# EAGLE design power-supply (EAGLE 7.3.0)
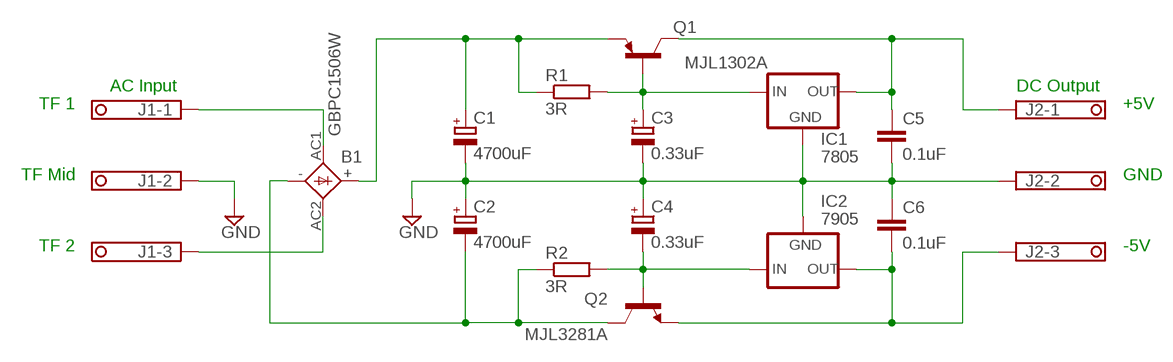
[diagram p0: schematic, sheet 1]

## Parts
B1  GBPC1506W  GBPC6  [GBPC6]
C1  4700uF  CPOL-EUE7.5-16  [E7,5-16]
C2  4700uF  CPOL-EUE7.5-16  [E7,5-16]
C3  0.33uF  CPOL-EUE2.5-5  [E2,5-5]
C4  0.33uF  CPOL-EUE2.5-5  [E2,5-5]
C5  0.1uF  C-EU102-054X133  [C102-054X133]
C6  0.1uF  C-EU102-054X133  [C102-054X133]
IC1  7805  78XXS  [78XXS]
IC2  7905  79XXS  [79XXS]
J1  1751251  [1751251]
J2  1751251  [1751251]
Q1  MJL1302A  [TO-264]
Q2  MJL3281A  [TO-264]
R1  3R  R-EU_0411/15  [0411/15]
R2  3R  R-EU_0411/15  [0411/15]

## Nets
GND: C1.- C2.+ C3.- C4.+ C5.2 C6.1 IC1.GND IC2.GND J1.2 J2.2
N$1: B1.AC1 J1.1
N$2: B1.AC2 J1.3
N$3: B1.+ C1.+ Q1.EMITTER R1.1
N$5: C3.+ IC1.IN Q1.BASE R1.2
N$6: C5.1 IC1.OUT J2.1 Q1.COLLECTOR
N$7: C4.- IC2.IN Q2.BASE R2.2
N$8: B1.- C2.- Q2.COLLECTOR R2.1
N$11: C6.2 IC2.OUT J2.3 Q2.EMITTER

## Notes on the sheet
- AC Input | DC Output
- TF 1 | +5V
- TF Mid | GND
- TF 2 | -5V

## Library data of the parts
B1 = rectifier:GBPC6: GENERAL INSTRUMENT RECTIFIER
C1-C4 = rcl:CPOL-EU: POLARIZED CAPACITOR, European symbol
C5 C6 = rcl:C-EU: CAPACITOR, European symbol
IC1 = v-reg:78XXS: VOLTAGE REGULATOR
IC2 = v-reg:79XXS: VOLTAGE REGULATOR
J1 J2 = con-phoenix-350:1751251: MKDS 1/ 3-3,5 Printklemme Nennstrom: 10 A Bemessungsspannung: 160 V Raster: 3,5 mm Polzahl: 3 Montageart: Löten Anschlussart: Schraubanschluss Anschlussrichtung vom Leiter zur Platine: 0° Source: http://eshop.phoenixcontact.com .. 1751251.pdf; OC_FARNELL: unknown; OC_NEWARK: unknown
Q1 = MJL1302A-MJL3281A:MJL1302A
Q2 = MJL1302A-MJL3281A:MJL3281A
R1 R2 = resistor:R-EU_: RESISTOR, European symbol

## Board
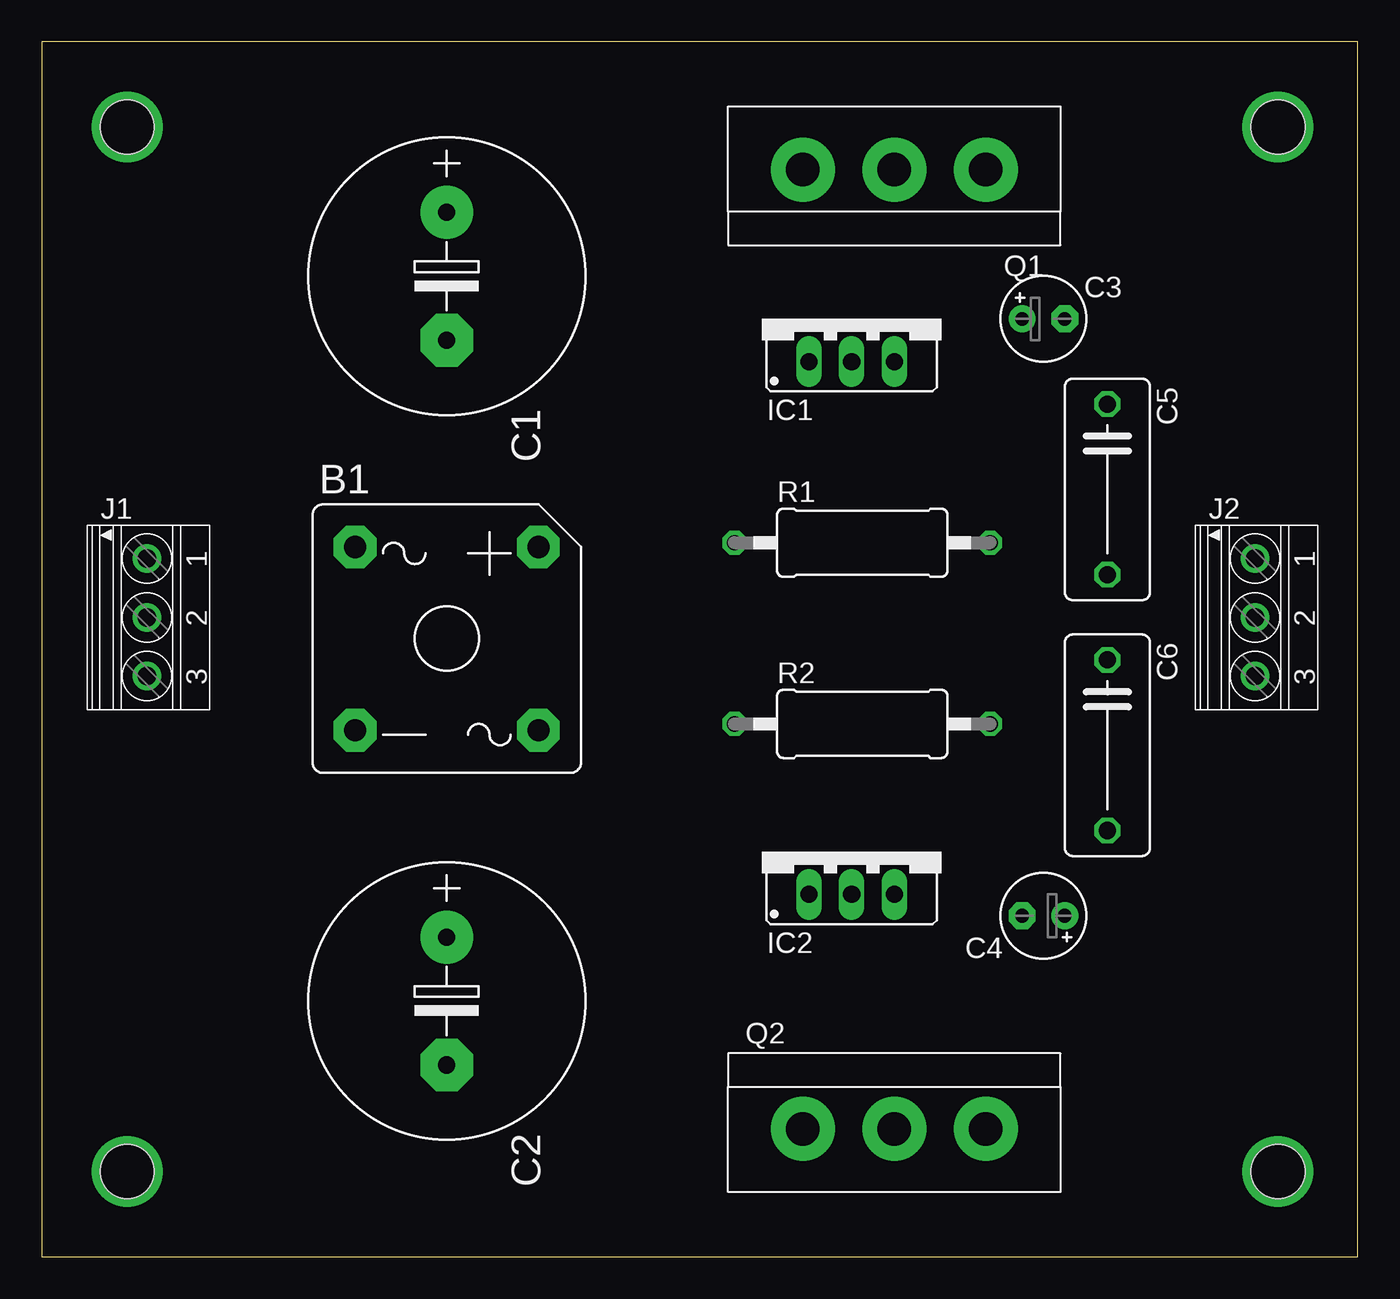
[diagram p1: board, top side]
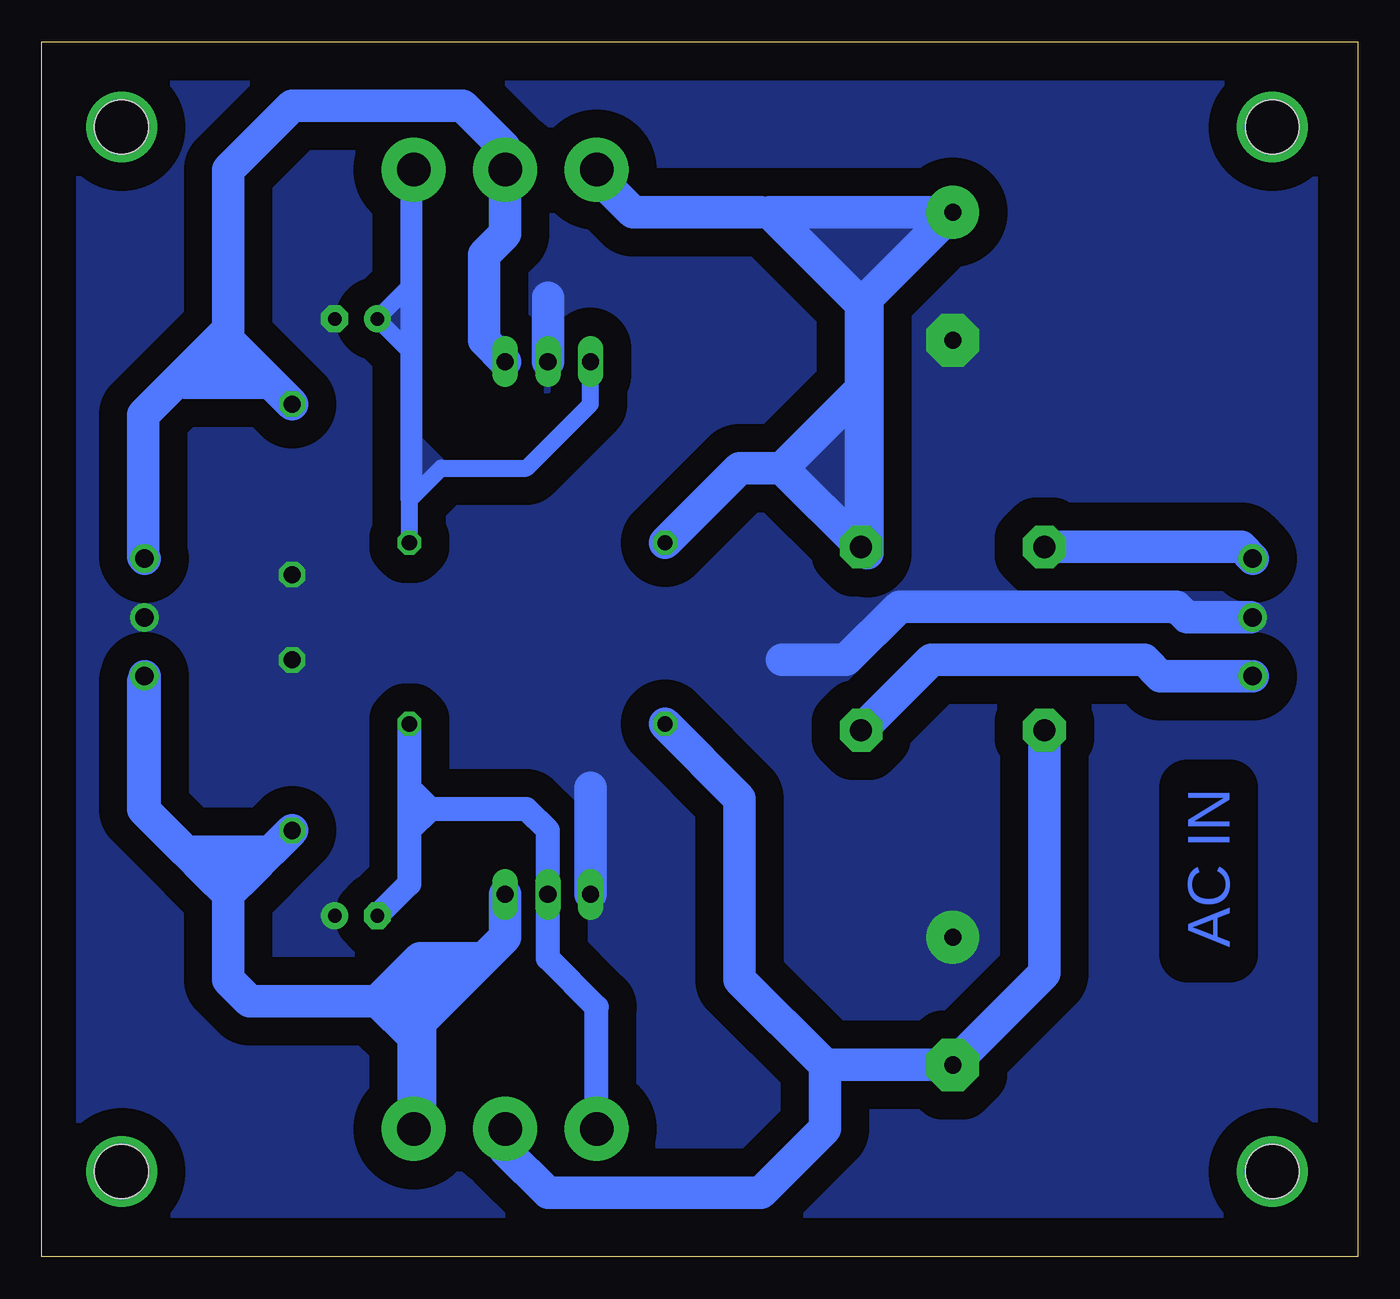
[diagram p2: board, bottom side, seen from below]

Size 78.41 x 72.38 mm. Coordinates in mm from the lower left corner, seen from the top.
Outline: 0,0 78.41,0 78.41,72.38 0,72.38 0,0
Copper layers (1*16): Top 0.035mm / dielectric 1mm / Bottom 0.035mm
Design rules "default *": minimum track width 10mil, minimum drill 24mil, track to track 8mil, track to pad 8mil, pad to pad 8mil, via to via 8mil, smd to smd 8mil, copper to edge 40mil, drill to drill 8mil, minimum pad ring 10mil, minimum via ring 8mil, stop-mask expansion 4mil, vias tented up to drill 0mil, thermal gap 10mil
Holes 3.2 mm at 5.08,67.31 73.66,67.31 5.08,5.08 73.66,5.08

### Footprints (pad centres in the part's own frame; a part is rotated, then mirrored left to right if it is on the bottom)
GBPC6 = drill 1.321 pad 2.54 octagon: + 5.461,5.461; - -5.461,-5.461; AC1 -5.461,5.461; AC2 5.461,-5.461
E7,5-16 = drill 1.016 pad 3.15: + -3.81,0 | drill 1.016 pad 3.15 octagon: - 3.81,0
E2,5-5 = drill 0.813 pad 1.6: + -1.27,0 | drill 0.813 pad 1.6 octagon: - 1.27,0
C102-054X133 = drill 1.016 octagon: 1 -5.08,0; 2 5.08,0
78XXS = drill 1.016 long: GND 0,-2.54; IN -2.54,-2.54; OUT 2.54,-2.54
79XXS = drill 1.016 long: GND -2.54,-2.54; IN 0,-2.54; OUT 2.54,-2.54
1751251 = drill 1.1 pad 1.7: 1 -3.5,-0.1; 2 0,-0.1; 3 3.5,-0.1
TO-264 = drill 2 pad 3.81: BASE -5.45,0; COLLECTOR 0,0; EMITTER 5.45,0
0411/15 = drill 0.914 octagon: 1 -7.62,0; 2 7.62,0

### Placement (x,y rotation side)
B1  24.13,36.83 0 top
C1  24.13,58.42 270 top
C2  24.13,15.24 270 top
C3  59.69,55.88 0 top
C4  59.69,20.32 180 top
C5  63.5,45.72 270 top
C6  63.5,30.48 270 top
IC1  48.26,55.88 0 top
IC2  48.26,24.13 0 top
J1  6.35,38.1 270 top
J2  72.39,38.1 270 top
Q1  50.8,64.77 180 top
Q2  50.8,7.62 0 top
R1  48.9,42.55 0 top
R2  48.9,31.75 0 top

### Tracks (layer width: path | path; a pad name or v marks a point on that pad's centre or on a via)
GND
  Bottom 1.93: IC1.GND 48.26,57.15 | 45.72,27.94 IC2.GND | 6.35,38.1 10.16,38.1 10.79,38.73 27.3,38.73 30.48,35.56 34.29,35.56
  pour Bottom (isolate 1.676, no thermals): 2.54,69.85 76.2,69.85 76.2,2.54 2.54,2.54
N$1
  Bottom 1.93: B1.AC1 6.94,42.29 J1.1
N$2
  Bottom 1.93: J1.3 11.74,34.6 12.7,35.56 25.4,35.56 B1.AC2
N$3
  Bottom 1.422: 35.05,62.23 35.56,62.23 42.81,62.23 Q1.EMITTER
  Bottom 1.93: 29.59,56.77 B1.+ 34.29,46.99 | 29.59,56.77 29.21,57.15 | 29.21,57.15 C1.+ 35.05,62.23 29.59,56.77 | 34.29,46.99 29.21,52.07 | 29.21,52.07 29.21,41.91 | 29.21,52.07 29.21,57.15 | R1.1 36.83,46.99 34.29,46.99 | 35.56,62.23 43.18,62.23 45.72,64.77
  pour Bottom: 24.13,62.23 29.21,57.15 34.29,62.23
  pour Bottom: 29.21,41.91 29.21,52.07 34.29,46.99
N$4  (via drill 3.2 pad 3.81)
  other vias: 73.66,67.31
N$5
  Bottom 1.016: Q1.BASE 56.25,45.35 | 56.25,45.35 56.52,45.09 | 56.52,45.09 R1.2 | 56.25,45.35 54.61,46.99 49.53,46.99 45.72,50.8 IC1.IN | 56.52,45.09 56.52,53.98 | 56.52,57.78 56.52,64.77 | 56.52,57.78 C3.+ 56.52,53.98 | 56.52,53.98 56.52,57.78
  pour Bottom: 54.61,46.99 56.52,48.9 56.52,45.09
  pour Bottom: 58.42,55.88 56.52,57.78 56.52,53.98
N$6
  Bottom 1.93: 67.31,54.61 67.31,55.24 | 67.31,55.24 67.31,64.77 63.5,68.58 53.34,68.58 50.8,66.04 Q1.COLLECTOR 50.8,60.96 52.07,59.69 52.07,54.61 IC1.OUT | 67.31,54.61 67.94,54.61 | 67.94,54.61 72.39,50.16 72.39,41.7 J2.1 | 67.94,54.61 67.31,55.24 | 67.31,54.61 66.04,53.34 | 66.04,53.34 64.77,52.07 | 64.77,52.07 C5.1 | 66.04,53.34 68.58,53.34 | 64.77,52.07 69.85,52.07
N$7
  Bottom 1.422: Q2.BASE 45.35,14.87 48.26,17.78 IC2.IN 48.26,25.4 49.53,26.67 55.24,26.67 | R2.2 56.52,27.94 | 56.52,27.94 56.52,26.04 | 56.52,25.4 56.52,22.23 C4.- | 55.24,26.67 55.88,26.67 56.52,26.04 | 56.52,26.04 56.52,25.4 | 56.52,25.4 55.24,26.67 | 55.24,26.67 56.52,27.94
N$8
  Bottom 1.93: 31.75,11.43 C2.- 18.67,16.89 B1.- | R2.1 36.83,27.3 36.83,16.51 31.75,11.43 | 31.75,11.43 31.75,7.62 35.56,3.81 48.26,3.81 50.8,6.35 Q2.COLLECTOR
N$9  (via drill 3.2 pad 3.81)
  other vias: 5.08,67.31
N$10  (via drill 3.2 pad 3.81)
  other vias: 5.08,5.08
N$11
  Bottom 1.93: J2.3 72.29,26.77 72.39,26.67 | 72.39,26.67 69.85,24.13 | 69.85,24.13 68.58,22.86 | 68.58,22.86 67.31,21.59 | 67.31,21.59 66.04,22.86 | 66.04,22.86 64.77,24.13 | 64.77,24.13 C6.2 | 67.31,21.59 67.31,16.51 66.04,15.24 58.42,15.24 | 64.77,24.13 69.85,24.13 | 66.04,22.86 68.58,22.86 | 72.39,26.67 72.39,34.29 | 52.07,17.78 50.8,19.05 IC2.OUT | 52.07,17.78 53.34,17.78 | 53.34,17.78 55.88,17.78 | Q2.EMITTER 56.25,13.07 | 56.25,13.07 58.42,15.24 | 55.88,7.62 55.88,12.7 | 55.88,13.97 55.88,15.24 | 55.88,15.24 55.88,17.78 | 55.88,17.78 58.42,15.24 | 56.25,13.07 55.88,12.7 | 55.88,12.7 55.88,13.97 | 55.88,13.97 57.15,15.24 | 53.34,17.78 55.88,15.24 | 55.88,13.97 52.07,17.78
N$12  (via drill 3.2 pad 3.81)
  other vias: 73.66,5.08

### Text on the board
Bottom: AC IN